# Altium schematic sheet moduloTransceptorRF.SchDoc
size A4
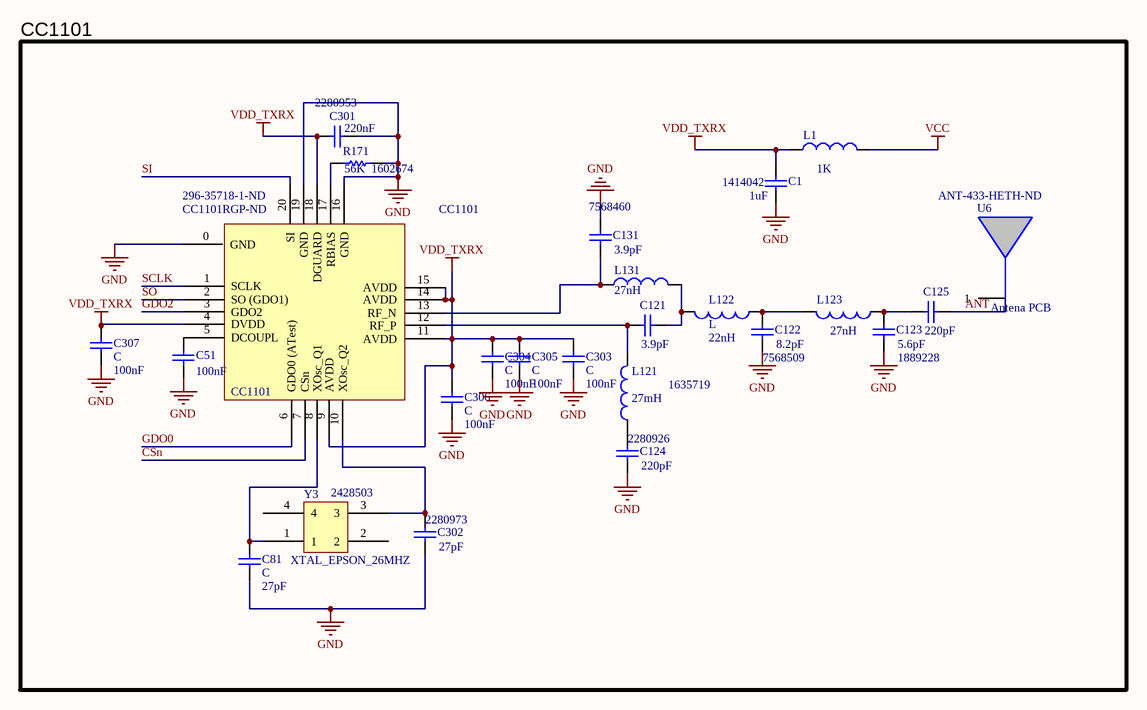
[diagram p0: moduloTransceptorRF.SchDoc]

## Parts
C1  value 1uF  Supplier Part Number 3: 1414042  [0805 CAP]  (hidden comment: C)
C51  value 100nF  [0805 CAP]  (hidden comment: C)
C81  C  value 27pF  [0805 CAP]
C121  value 3.9pF  [0805 CAP]  (hidden comment: C)
C122  value 8.2pF  Supplier Part Number 1: 7568509  [0805 CAP]  (hidden comment: C)
C123  value 5.6pF  Supplier Part Number 1: 1889228  [0805 CAP]  (hidden comment: C)
C124  value 220pF  Supplier Part Number 1: 2280926  [0805 CAP]  (hidden comment: C)
C125  value 220pF  [0805 CAP]  (hidden comment: C)
C131  value 3.9pF  Supplier Part Number 1: 7568460  [0805 CAP]  (hidden comment: C)
C301  value 220nF  Supplier Part Number 1: 2280953  [0805 CAP]  (hidden comment: C)
C302  value 27pF  Supplier Part Number 1: 2280973  [0805 CAP]  (hidden comment: C)
C303  C  value 100nF  [0805 CAP]
C304  C  value 100nF  [0805 CAP]
C305  C  value 100nF  [0805 CAP]
C306  C  value 100nF  [0805 CAP]
C307  C  value 100nF  [0805 CAP]
CC1101  Supplier Part Number 1: CC1101RGP-ND  Supplier Part Number 2: 296-35718-1-ND  [CC1101]  (hidden comment: CC1101 Transceiver)
L1  value 1K  [0805 Ind]  (hidden comment: L)
L121  value 27mH  Supplier Part Number 1: 1635719  [0805 Ind]  (hidden comment: L)
L122  L  value 22nH  [0805 Ind]
L123  value 27nH  [0805 Ind]  (hidden comment: L)
L131  value 27nH  [0805 Ind]  (hidden comment: L)
R171  value 56K  Supplier Part Number 1: 1602674  [0805 RES]  (hidden comment: R)
U6  Antena PCB  Supplier Part Number 1: ANT-433-HETH-ND  [ANT-433-HETH]
Y3  XTAL_EPSON_26MHZ  Supplier Part Number 1: 2428503  [XTAL_EPSON_26MHZ]

## Blocks framed on the sheet
CC1101: C1 C51 C81 C121-C125 C131 C301-C307 CC1101 L1 L121-L123 L131 R171 U6 Y3

## Nets
GND: C1.1 C51.1 C81.1 C122.1 C123.1 C124.1 C131.2 C301.2 C302.1 C303.1 C304.1 C305.1 C306.1 C307.1 CC1101.0(GND) CC1101.16(GND) CC1101.19(GND) R171.1
VCC: L1.2
VDD_TXRX: C1.2 C301.1 C303.2 C304.2 C305.2 C306.2 C307.2 CC1101.4(DVDD) CC1101.9(AVDD) CC1101.11(AVDD) CC1101.14(AVDD) CC1101.15(AVDD) CC1101.18(DGUARD) L1.1
ANT: C125.2 U6.1
CSn: CC1101.7(CSn)
GDO0: CC1101.6(GDO0_(ATest))
GDO2: CC1101.3(GDO2)
SCLK: CC1101.1(SCLK)
SI: CC1101.20(SI)
SO: CC1101.2(SO_(GDO1))
NetC51_2: C51.2 CC1101.5(DCOUPL)
NetC81_2: C81.2 CC1101.8(XOsc_Q1) Y3.1
NetC121_1: C121.1 CC1101.12(RF_P) L121.2
NetC121_2: C121.2 L122.2 L131.2
NetC122_2: C122.2 L122.1 L123.2
NetC123_2: C123.2 C125.1 L123.1
NetC124_2: C124.2 L121.1
NetC131_1: C131.1 CC1101.13(RF_N) L131.1
NetC302_2: C302.2 CC1101.10(XOsc_Q2) Y3.3
NetCC1101_17: CC1101.17(RBIAS) R171.2

Not connected (* = marked no-connect by the designer): Y3 2 4

## Library data of the parts
C1 C51 C81 C121-C125 C131 C301-C307 = C: Capacitor; Manufacturer: Generic Components; Class: Passive; Published: 08/06/2000; Publisher: Altium Hobart Technology Centre; SubClass: Capacitor
  C1: Supplier 1: Digi-Key; Supplier 2: Farnell; Supplier 3: Farnell
  C122-C125 C131 C301 C302: Supplier 1: Farnell
L1 L121-L123 L131 = L: Inductor; Manufacturer: Generic Components; Class: Passive; Published: 08/06/2000; Publisher: Altium Hobart Technology Centre; SubClass: Inductor
  L121: Supplier 1: Farnell
R171 = R: Resistor; Manufacturer: Generic Components; Class: Passive; Published: 08/06/2000; Publisher: Altium Hobart Technology Centre; SubClass: Resistor; Supplier 1: Farnell
U6 = Antena PCB: Note: Not recommended for new designs. Consider PIC16C72A or PIC16F72 instead.; Published: 8-Jun-2000; LatestRevisionDate: 13-Apr-2006; LatestRevisionNote: IPC-7351 Footprint Added.; DatasheetVersion: DS39016A_1998; PackageVersion: 2005; PackageReference: SOIC300-28; Publisher: Altium Limited; PackageDescription: 28-Pin Small Outline Integrated Circuit 1.27 mm Pitch; Code_JEDEC: MS-013; ComponentLink1Description: Manufacturer Link; ComponentLink1URL: http://www.microchip.com; ComponentLink2Description: Datasheet; ComponentLink2URL: http://ww1.microchip.com/downloads/en/DeviceDoc/39016a.pdf; ComponentLink3Description: Packaging Specification; ComponentLink3URL: http://ww1.microchip.com/downloads/en/PackagingSpec/00049AD.pdf; Supplier 1: Digi-Key
Y3 = XTAL_EPSON_26MHZ: Pin 2 and 4 to ground; Supplier 1: Farnell
CC1101 = CC1101 Transceiver: Supplier 1: Digi-Key; Supplier 2: Digi-Key